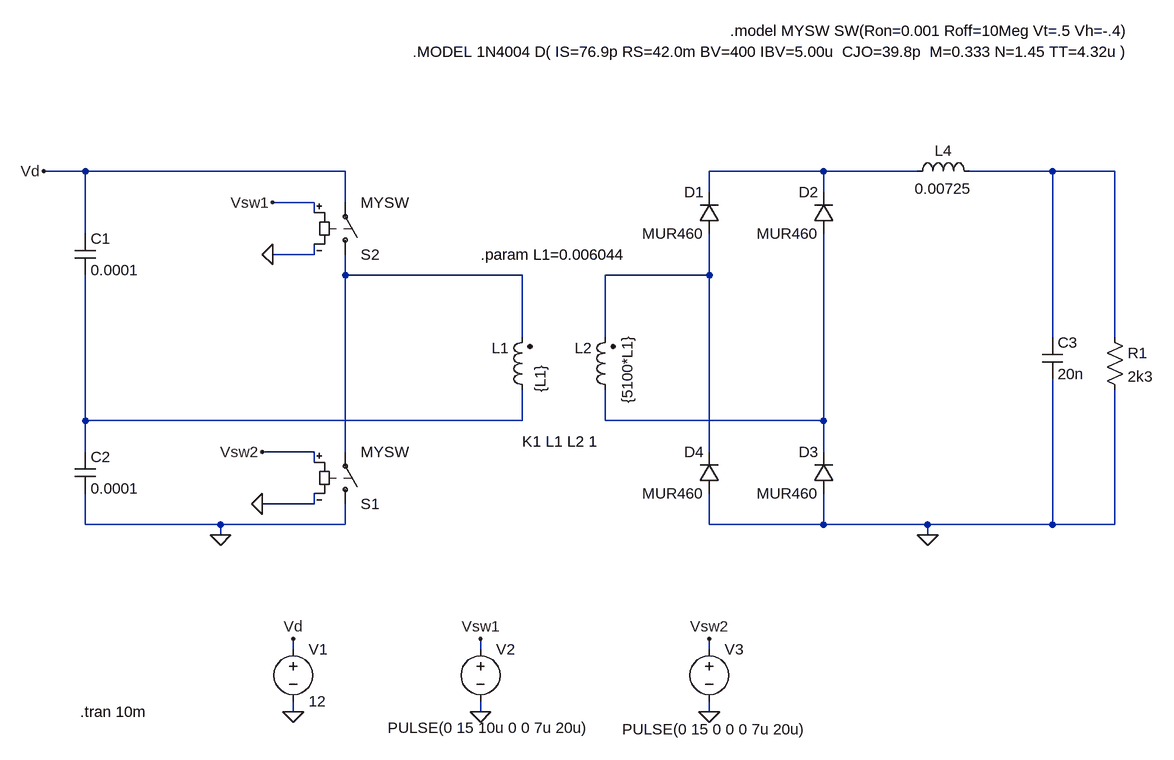
[diagram p0: schematic half_bridge_sim.asc]
half_bridge_sim.asc, the LTspice schematic file:
Version 4
SHEET 1 1848 936
WIRE -288 -240 -352 -240
WIRE 112 -240 -288 -240
WIRE 848 -240 672 -240
WIRE 992 -240 848 -240
WIRE 1200 -240 1072 -240
WIRE 1296 -240 1200 -240
WIRE 672 -208 672 -240
WIRE 848 -208 848 -240
WIRE 64 -192 0 -192
WIRE 112 -192 112 -240
WIRE 64 -176 64 -192
WIRE -288 -144 -288 -240
WIRE 64 -112 64 -128
WIRE 64 -112 0 -112
WIRE 112 -80 112 -112
WIRE 384 -80 112 -80
WIRE 672 -80 672 -144
WIRE 672 -80 512 -80
WIRE 384 16 384 -80
WIRE 512 16 512 -80
WIRE 1200 16 1200 -240
WIRE 1296 16 1296 -240
WIRE -288 144 -288 -80
WIRE 384 144 384 96
WIRE 384 144 -288 144
WIRE 512 144 512 96
WIRE 848 144 848 -144
WIRE 848 144 512 144
WIRE -288 192 -288 144
WIRE 64 192 -16 192
WIRE 112 192 112 -80
WIRE 672 192 672 -80
WIRE 848 192 848 144
WIRE 64 208 64 192
WIRE 64 272 64 256
WIRE 64 272 -16 272
WIRE -288 304 -288 256
WIRE -80 304 -288 304
WIRE 112 304 112 272
WIRE 112 304 -80 304
WIRE 672 304 672 256
WIRE 848 304 848 256
WIRE 848 304 672 304
WIRE 1008 304 848 304
WIRE 1200 304 1200 80
WIRE 1200 304 1008 304
WIRE 1296 304 1296 96
WIRE 1296 304 1200 304
WIRE -80 320 -80 304
WIRE 1008 320 1008 304
WIRE 32 496 32 480
WIRE 320 496 320 480
WIRE 672 496 672 480
WIRE 32 592 32 576
WIRE 320 592 320 576
WIRE 672 592 672 576
FLAG 32 592 0
FLAG 1008 320 0
FLAG 320 592 0
FLAG 672 592 0
FLAG 32 480 Vd
FLAG -352 -240 Vd
FLAG -80 320 0
FLAG 0 -112 0
FLAG -16 272 0
FLAG 320 480 Vsw1
FLAG 672 480 Vsw2
FLAG 0 -192 Vsw1
FLAG -16 192 Vsw2
SYMBOL voltage 32 480 R0
WINDOW 123 0 0 Left 0
WINDOW 39 0 0 Left 0
SYMATTR InstName V1
SYMATTR Value 12
SYMBOL cap -304 -144 R0
SYMATTR InstName C1
SYMATTR Value 0.0001
SYMBOL cap -304 192 R0
SYMATTR InstName C2
SYMATTR Value 0.0001
SYMBOL cap 1184 16 R0
SYMATTR InstName C3
SYMATTR Value 20n
SYMBOL ind 976 -224 R270
WINDOW 0 32 56 VTop 2
WINDOW 3 5 56 VBottom 2
SYMATTR InstName L4
SYMATTR Value 0.00725
SYMBOL sw 112 288 M180
SYMATTR InstName S1
SYMATTR Value MYSW
SYMBOL sw 112 -96 M180
SYMATTR InstName S2
SYMATTR Value MYSW
SYMBOL voltage 320 480 R0
WINDOW 123 0 0 Left 0
WINDOW 39 0 0 Left 0
WINDOW 3 -143 137 Left 2
SYMATTR InstName V2
SYMATTR Value PULSE(0 15 10u 0 0 7u 20u)
SYMBOL voltage 672 480 R0
WINDOW 123 0 0 Left 0
WINDOW 39 0 0 Left 0
WINDOW 3 -134 139 Left 2
SYMATTR InstName V3
SYMATTR Value PULSE(0 15 0 0 0 7u 20u)
SYMBOL ind2 400 112 R180
WINDOW 0 36 80 Left 2
WINDOW 3 -12 11 VRight 2
SYMATTR InstName L1
SYMATTR Value {L1}
SYMATTR Type ind
SYMBOL ind2 528 112 R180
WINDOW 0 36 80 Left 2
WINDOW 3 -18 -6 VRight 2
SYMATTR InstName L2
SYMATTR Value {5100*L1}
SYMATTR Type ind
SYMBOL res 1280 0 R0
SYMATTR InstName R1
SYMATTR Value 2k3
SYMBOL diode 688 -144 R180
WINDOW 0 24 64 Left 2
WINDOW 3 24 0 Left 2
SYMATTR InstName D1
SYMATTR Value MUR460
SYMBOL diode 864 -144 R180
WINDOW 0 24 64 Left 2
WINDOW 3 24 0 Left 2
SYMATTR InstName D2
SYMATTR Value MUR460
SYMBOL diode 864 256 R180
WINDOW 0 24 64 Left 2
WINDOW 3 24 0 Left 2
SYMATTR InstName D3
SYMATTR Value MUR460
SYMBOL diode 688 256 R180
WINDOW 0 24 64 Left 2
WINDOW 3 24 0 Left 2
SYMATTR InstName D4
SYMATTR Value MUR460
TEXT -296 592 Left 2 !.tran 10m
TEXT 384 176 Left 2 !K1 L1 L2 1
TEXT 704 -456 Left 2 !.model MYSW SW(Ron=0.001 Roff=10Meg Vt=.5 Vh=-.4)
TEXT 320 -112 Left 2 !.param L1=0.006044
TEXT 216 -424 Left 2 !.MODEL 1N4004 D( IS=76.9p RS=42.0m BV=400 IBV=5.00u  CJO=39.8p  M=0.333 N=1.45 TT=4.32u )

The netlist it stands for:
* half_bridge_sim.asc
V1 Vd 0 12
C1 Vd N005 0.0001
C2 N005 0 0.0001
C3 N002 0 20n
L4 N001 N002 0.00725
S1 0 N003 Vsw2 0 MYSW
S2 N003 Vd Vsw1 0 MYSW
V2 Vsw1 0 PULSE(0 15 10u 0 0 7u 20u)
V3 Vsw2 0 PULSE(0 15 0 0 0 7u 20u)
L1 N005 N003 {L1}
L2 N006 N004 {5100*L1}
R1 N002 0 2k3
D1 N004 N001 MUR460
D2 N006 N001 MUR460
D3 0 N006 MUR460
D4 0 N004 MUR460
.model D D
.lib standard.dio
.tran 10m
K1 L1 L2 1
.model MYSW SW(Ron=0.001 Roff=10Meg Vt=.5 Vh=-.4)
.param L1=0.006044
.MODEL 1N4004 D( IS=76.9p RS=42.0m BV=400 IBV=5.00u  CJO=39.8p  M=0.333 N=1.45 TT=4.32u )
.backanno
.end